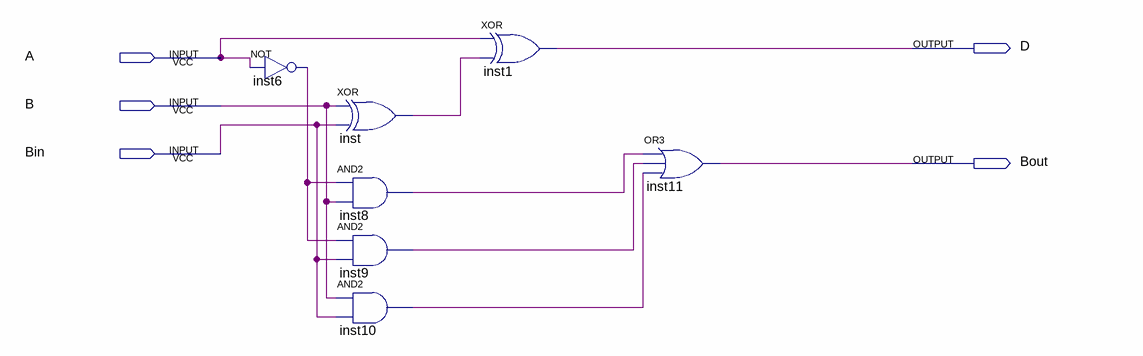
[diagram p0: schematic sheet]
// Quartus schematic subtrator.bdf as structural Verilog: 7 symbols, 5 pins
module subtrator (
  input  A,
  input  B,
  input  Bin,
  output D,
  output Bout
);

  wire inst6_out, inst8_out, inst9_out, inst10_out, inst_out;

  not inst6 (inst6_out, A);
  xor inst (inst_out, B, Bin);
  and inst8 (inst8_out, inst6_out, B);
  and inst9 (inst9_out, inst6_out, Bin);
  and inst10 (inst10_out, B, Bin);
  xor inst1 (D, A, inst_out);
  or inst11 (Bout, inst8_out, inst9_out, inst10_out);
endmodule
